# EAGLE schematic board-beta (EAGLE 7.7.0)
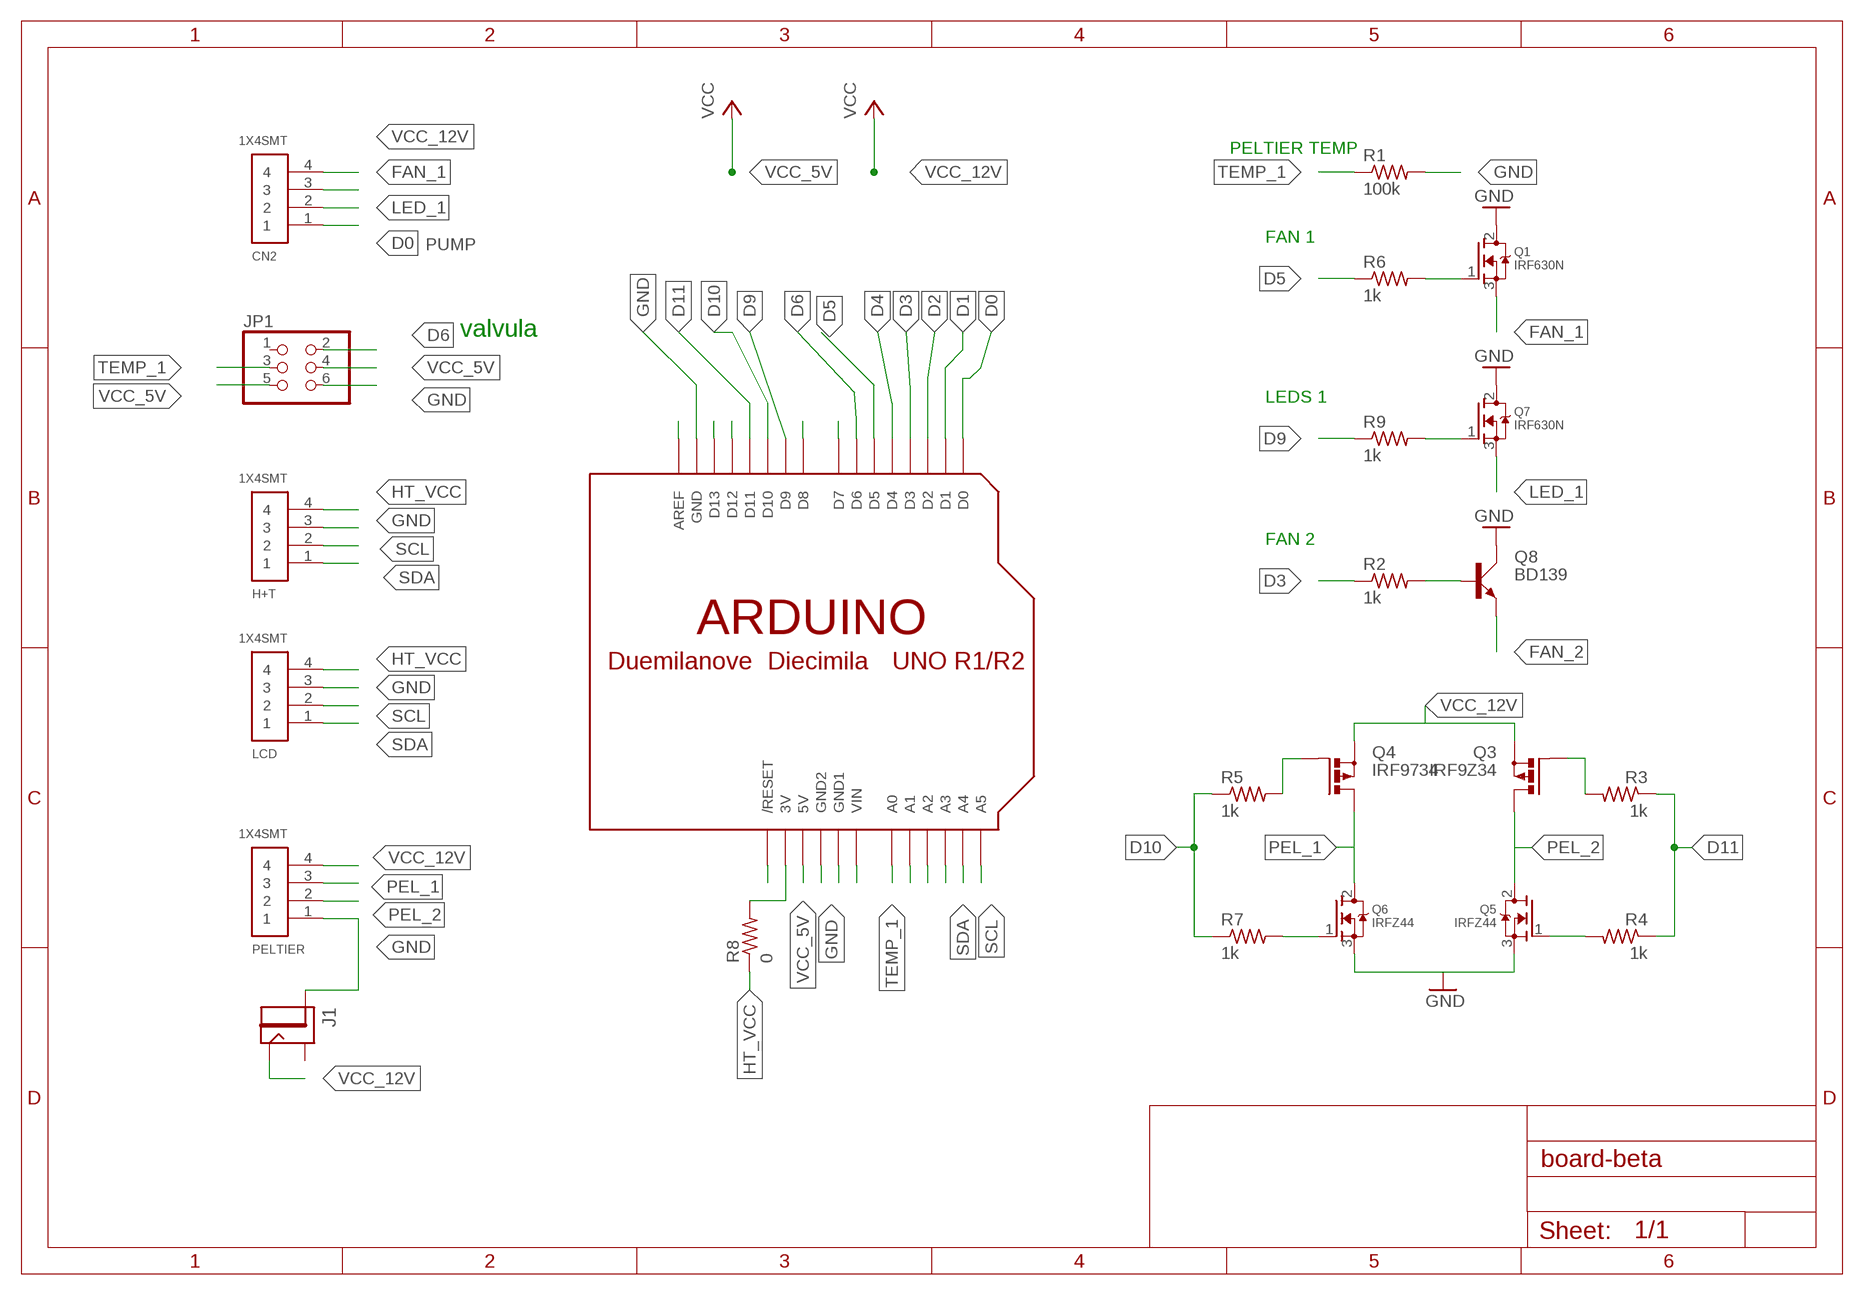
[diagram p0: schematic, sheet 1]

## Parts
CN2  1X4SMT  [1X4-SMT]
H+T  1X4SMT  [1X4-SMT]
J1  JACK2.1MM  [JACK_2.1MM]
JP1  PINHD-2X3-SMD  [2X03SMD]
LCD  1X4SMT  [1X4-SMT]
PELTIER  1X4SMT  [1X4-SMT]
Q1  IRF630N  MOSFET-NGDS_TO220V  [TO220V]
Q3  IRF9Z34  PMOSFET_PTO220BV  [TO220BV]
Q4  IRF9734  PMOSFET_PTO220BV  [TO220BV]
Q5  IRFZ44  MOSFET-NGDS_TO220V  [TO220V]
Q6  IRFZ44  MOSFET-NGDS_TO220V  [TO220V]
Q7  IRF630N  MOSFET-NGDS_TO220V  [TO220V]
Q8  BD139  [TO126AV]
R1  100k  RES-US1206FAB  [R1206FAB]
R2  1k  RES-US1206FAB  [R1206FAB]
R3  1k  RES-US1206FAB  [R1206FAB]
R4  1k  RES-US1206FAB  [R1206FAB]
R5  1k  RES-US1206FAB  [R1206FAB]
R6  1k  RES-US1206FAB  [R1206FAB]
R7  1k  RES-US1206FAB  [R1206FAB]
R8  0  RES-US1206FAB  [R1206FAB]
R9  1k  RES-US1206FAB  [R1206FAB]
U$1  ARDUINOUNO  [ARDUINO]

## Nets
D0: CN2.1 U$1.D0
D1: U$1.D1
D2: U$1.D2
D3: R2.1 U$1.D3
D4: U$1.D4
D5: R6.1 U$1.D5
D6: JP1.2 U$1.D6
D9: R9.1 U$1.D9
D10: R5.1 R7.1 U$1.D10
D11: R3.1 R4.1 U$1.D11
FAN_1: CN2.3 Q1.3(S)
FAN_2: Q8.E
GND: H+T.3 J1.PIN JP1.6 LCD.3 PELTIER.1 Q1.2(D) Q5.3(S) Q6.3(S) Q7.2(D) Q8.C R1.2 U$1.GND U$1.GND2
HT_VCC: H+T.4 LCD.4 R8.1
LED_1: CN2.2 Q7.3(S)
N$1: Q1.1(G) R6.2
N$3: Q4.G R5.2
N$4: U$1.D8
N$5: Q3.G R3.2
N$7: R8.2 U$1.3V
N$8: U$1.D7
N$9: Q5.1(G) R4.2
N$10: Q6.1(G) R7.2
N$11: Q8.B R2.2
N$12: Q7.1(G) R9.2
N$13: U$1.D12
N$14: U$1.D13
N$16: U$1.AREF
N$19: U$1.A3
N$20: U$1.A2
N$21: U$1.A1
N$23: U$1.VIN
N$24: U$1.GND1
N$28: U$1.RESET(/RESET)
PEL_1: PELTIER.3 Q4.D Q6.2(D)
PEL_2: PELTIER.2 Q3.D Q5.2(D)
SCL: H+T.2 LCD.2 U$1.A5
SDA: H+T.1 LCD.1 U$1.A4
TEMP_1: JP1.3 R1.1 U$1.A0
VCC_5V: JP1.4 JP1.5 U$1.5V ; supply symbol labelled VCC
VCC_12V: CN2.4 J1.CONTACT PELTIER.4 Q3.S Q4.S ; supply symbol labelled VCC
Unconnected: J1.SHUNT JP1.1

## Notes on the sheet
- PELTIER TEMP
- FAN 1
- PUMP
- valvula
- LEDS 1
- FAN 2

## Library data of the parts
CN2 H+T LCD PELTIER = adafruit:1X4: 4-pin connector
J1 = fab:JACK
JP1 = fab:PINHD-2X3-SMD: PIN HEADER
Q1 Q5-Q7 = adafruit:MOSFET-N: N-Channel Mosfet 2N7002E - 60V 260mA SOT23 [Digikey: 2N7002ET1GOSTR-ND] - REEL BSH103 - 30V 850mA SOT23 [Digikey: 568-5013-1-ND]
Q3 Q4 = transistor-power:PMOSFET_P: Power MOSFET P-Channel
Q8 = transistor-power:BD139: NPN TRANSISTOR
R1-R9 = fab:RES-US: Resistor (US Symbol) Variants with postfix FAB are widened to allow the routing of internal traces
U$1 = adafruit:ARDUINO: Arduino Diecimila/Duemilanove Make a shield with ease, this package has all the named pins as well as the two mounting drill holes and an outline of the USB and DC power connector. The outline is on the DIMENSION layer, so if your board house uses it they will cut the outline to match. http://www.ladyada.net/library/pcb/eaglelibrary.html